# Altium schematic sheet SD.SchDoc: MicroSD slot
size A4
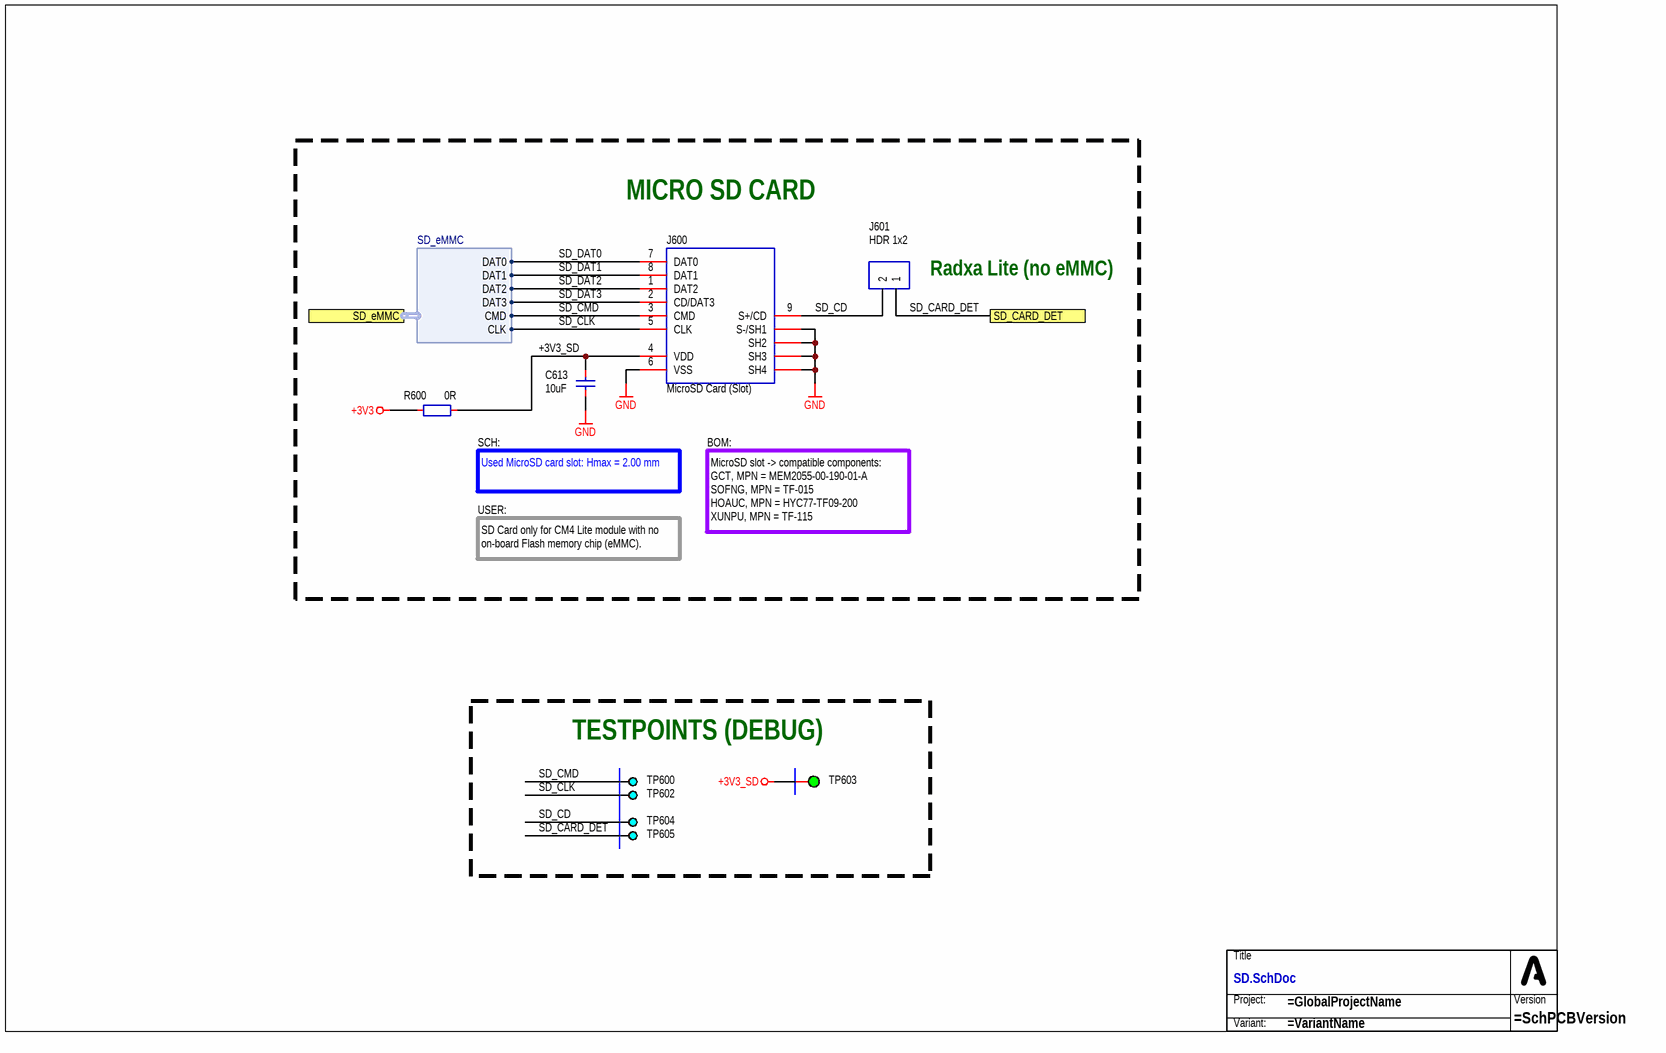
[diagram p0: SD.SchDoc]

## Parts
C613  10uF  [CAP_0603_R]
J600  MicroSD Card (Slot)  [CON_GCT_MEM2055_R]
J601  HDR 1x2  [CON_HEADER_TMV_1X2_P254H857]
R600  0R  [RES_0603_R]
TB?  (no value)  (no BOM)
TP600  DEBUG  [PCB_TP_DBG_50]  (value not drawn)  (no BOM)
TP602  DEBUG  [PCB_TP_DBG_50]  (value not drawn)  (no BOM)
TP603  ICT  [PCB_TP_ICT_100]  (value not drawn)  (no BOM)
TP604  DEBUG  [PCB_TP_DBG_50]  (value not drawn)  (no BOM)
TP605  DEBUG  [PCB_TP_DBG_50]  (value not drawn)  (no BOM)

## Ports
SD_CARD_DET, SD_eMMC (harness SD_eMMC)

## Harnesses
SD_eMMC: DAT0, DAT1, DAT2, DAT3, CMD, CLK

## Nets
+3V3: R600.2
+3V3_SD: C613.2 J600.4(VDD) R600.1 TP603.1
GND: C613.1 J600.6(VSS) J600.SH1(S-/SH1) J600.SH2 J600.SH3 J600.SH4
SD_CARD_DET: J601.1 TP605.1 ; port SD_CARD_DET
SD_CD: J600.9(S+/CD) J601.2 TP604.1
SD_CLK: J600.5(CLK) TP602.1 ; port SD_eMMC.CLK
SD_CMD: J600.3(CMD) TP600.1 ; port SD_eMMC.CMD
SD_DAT0: J600.7(DAT0) ; port SD_eMMC.DAT0
SD_DAT1: J600.8(DAT1) ; port SD_eMMC.DAT1
SD_DAT2: J600.1(DAT2) ; port SD_eMMC.DAT2
SD_DAT3: J600.2(CD/DAT3) ; port SD_eMMC.DAT3

## Notes on the sheet
- MICRO SD CARD
- (near J601) Radxa Lite (no eMMC)
- (near R600) SCH:
- BOM:
- USER:
- Used MicroSD card slot: Hmax = 2.00 mm
- SD Card only for CM4 Lite module with no on-board Flash memory chip (eMMC).
- MicroSD slot -> compatible components:
  GCT, MPN = MEM2055-00-190-01-A
  SOFNG, MPN = TF-015
  HOAUC, MPN = HYC77-TF09-200
  XUNPU, MPN = TF-115
- TESTPOINTS (DEBUG)
- (in symbol SCH_TITLE_BLOCK_SIMPLE_NODATE) Title; Project:; Version; Variant:

## Library data of the parts
C613 = CAP-0023: CAP SMD 10u/10V ±10% 10V X5R (0603); Manufacturer: Samsung Electro-Mechanics; MPN: CL10A106KP8NNNC; Component Subtype: MLCC; Package (Case): 0603; Component Type: Capacitor; Value: 10uF; Mounting Type: SMD
J600 = CON_GCT_MEM2055: Connector; MicroSD Card Connector;; Manufacturer: TF-015; Package (Case): SMD; MPN: TF-015; Value: MicroSD Card (Slot); Component Subtype: MicroSD Card; Component Type: Card Socket; Mounting Type: SMD
J601 = ITEM_J10014: CONN THT / HEADER / PITCH 2,54mm / VERTICAL / (2 PIN); Manufacturer: Ckmtw(Shenzhen Cankemeng); MPN: B-2100S02P-A110; Component Subtype: Pin Header; Mounting Type: THT; Component Type: Connector; Package (Case): THT; Value: HDR 1x2
R600 = RES-0054: Resistor; Thick Film; 0R; SMD; 0603 (1608);; Manufacturer: UNI-ROYAL(Uniroyal Elec); MPN: 0603WAF0000T5E; Package (Case): 0603; Component Type: Resistor; Component Subtype: Thick Film; Value: 0R; Mounting Type: SMD
TB? = SCH_TITLE_BLOCK_SIMPLE_NODATE
TP600 TP602 TP604 TP605 = PCB_TP_DBG: PCB Marking; Test Point (Debug);; Value: DEBUG; Component Type: Testpoint
TP603 = PCB_TP_ICT: Test Point (ICT); Component Type: Testpoint (for ICT); Mounting Type: Non component; Value: ICT